# Altium schematic sheet GyroMPU.SchDoc
size 209 x 148 mm
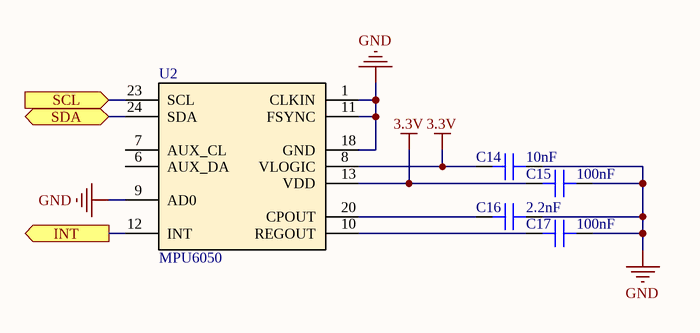
[diagram p0: GyroMPU.SchDoc]

## Parts
C14  10nF  [CAP 0603_1608]
C15  100nF  [CAP 0603_1608]
C16  2.2nF  [CAP 0603_1608]
C17  100nF  [CAP 0603_1608]
U2  MPU6050  [QFN-24TA]

## Ports
INT (out), SCL (in), SDA (bidir)

## Nets
3.3V: C14.2 C15.2 U2.8(VLOGIC) U2.13(VDD)
GND: C14.1 C15.1 C16.2 C17.2 U2.1(CLKIN) U2.9(AD0) U2.11(FSYNC) U2.18(GND)
INT: U2.12(INT) ; port INT
SCL: U2.23(SCL) ; port SCL
SDA: U2.24(SDA) ; port SDA
NetC16_1: C16.1 U2.20(CPOUT)
NetC17_1: C17.1 U2.10(REGOUT)

Not connected (* = marked no-connect by the designer): U2 6(AUX_DA) 7(AUX_CL)

## Library data of the parts
C14-C17 = Cap 0603: SMT Capacitor
  C14: VALUE: 10nF
  C15 C17: VALUE: 100nF
  C16: VALUE: 2.2nF